# EAGLE design gameboy (EAGLE 9.4.0)
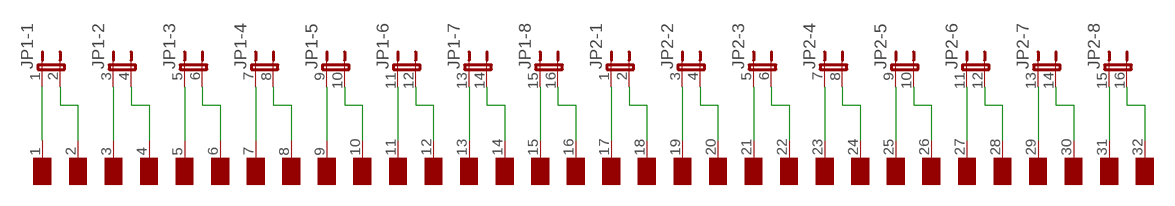
[diagram p0: schematic, sheet 1]

## Parts
JP1  JP8QE  [JP8Q]
JP2  JP8QE  [JP8Q]
U$1  CONNECTOR  [CONNECTOR]

## Nets
N$1: JP1.1 U$1.1(VDD)
N$2: JP1.2 U$1.2(NC)
N$3: JP1.3 U$1.3(/WR)
N$4: JP1.4 U$1.4(/RD)
N$5: JP1.5 U$1.5(/RCS)
N$6: JP1.6 U$1.6(A0)
N$7: JP1.7 U$1.7(A1)
N$8: JP1.8 U$1.8(A2)
N$9: JP1.9 U$1.9(A3)
N$10: JP1.10 U$1.10(A4)
N$11: JP1.11 U$1.11(A5)
N$12: JP1.12 U$1.12(A6)
N$13: JP1.13 U$1.13(A7)
N$14: JP1.14 U$1.14(A8)
N$15: JP1.15 U$1.15(A9)
N$16: JP1.16 U$1.16(A10)
N$17: JP2.1 U$1.17(A11)
N$18: JP2.2 U$1.18(A12)
N$19: JP2.3 U$1.19(A13)
N$20: JP2.4 U$1.20(A14)
N$21: JP2.5 U$1.21(A15)
N$22: JP2.6 U$1.22(D0)
N$23: JP2.7 U$1.23(D1)
N$24: JP2.8 U$1.24(D2)
N$25: JP2.9 U$1.25(D3)
N$26: JP2.10 U$1.26(D4)
N$27: JP2.11 U$1.27(D5)
N$28: JP2.12 U$1.28(D6)
N$29: JP2.13 U$1.29(D7)
N$30: JP2.14 U$1.30(/RS)
N$31: JP2.15 U$1.31(VIN)
N$32: JP2.16 U$1.32(GND)

## Library data of the parts
JP1 JP2 = jumper:JP8QE: JUMPER
U$1 = gameboy:CONNECTOR: Connector Pads for Gameboy Cartridges

## Board
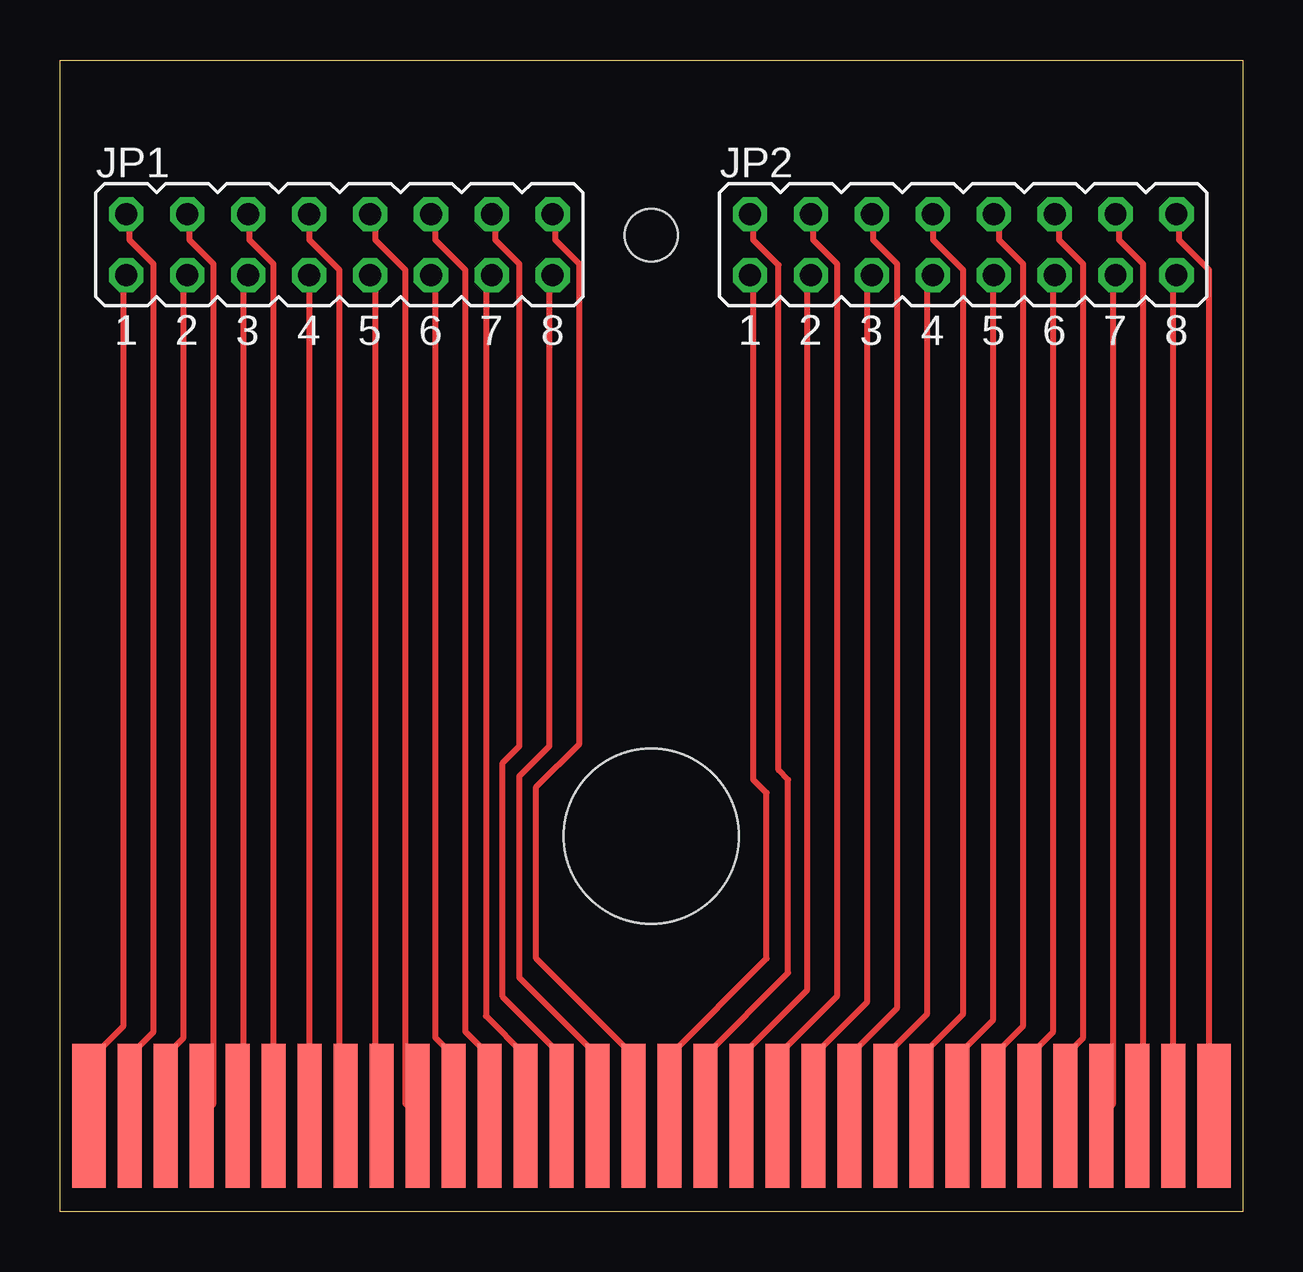
[diagram p1: board, top side]

Size 49.3 x 48 mm. Coordinates in mm from the lower left corner, seen from the top.
Outline: 0,48 49.3,48 49.3,0 0,0 0,48
Copper layers (1*16): Top 0.035mm / dielectric 1.5mm / Bottom 0.035mm
Design rules "default": minimum track width 10mil, minimum drill 24mil, track to track 8mil, track to pad 8mil, pad to pad 8mil, via to via 8mil, smd to smd 8mil, copper to edge 40mil, drill to drill 8mil, minimum pad ring 10mil, minimum via ring 8mil, stop-mask expansion 4mil, vias tented up to drill 0mil, thermal gap 10mil
Holes 7.3 mm at 24.65,15.65
Holes 2.2 mm at 24.65,40.7

### Footprints (pad centres in the part's own frame; a part is rotated, then mirrored left to right if it is on the bottom)
JP8Q = drill 0.914 octagon: 1 -8.89,-1.27; 2 -8.89,1.27; 3 -6.35,-1.27; 4 -6.35,1.27; 5 -3.81,-1.27; 6 -3.81,1.27; 7 -1.27,-1.27; 8 -1.27,1.27; 9 1.27,-1.27; 10 1.27,1.27; 11 3.81,-1.27; 12 3.81,1.27; 13 6.35,-1.27; 14 6.35,1.27; 15 8.89,-1.27; 16 8.89,1.27
CONNECTOR = smd 1.4 x 6: 1 0.7,-3; 32 47.6,-3 | smd 1 x 6: 2 2.4,-3; 3 3.9,-3; 4 5.4,-3; 5 6.9,-3; 6 8.4,-3; 7 9.9,-3; 8 11.4,-3; 9 12.9,-3; 10 14.4,-3; 11 15.9,-3; 12 17.4,-3; 13 18.9,-3; 14 20.4,-3; 15 21.9,-3; 16 23.4,-3; 17 24.9,-3; 18 26.4,-3; 19 27.9,-3; 20 29.4,-3; 21 30.9,-3; 22 32.4,-3; 23 33.9,-3; 24 35.4,-3; 25 36.9,-3; 26 38.4,-3; 27 39.9,-3; 28 41.4,-3; 29 42.9,-3; 30 44.4,-3; 31 45.9,-3

### Placement (x,y rotation side)
JP1  11.65,40.3 0 top
JP2  37.65,40.3 0 top
U$1  0.5,7 0 top

### Tracks (layer width: path | path; a pad name or v marks a point on that pad's centre or on a via)
N$1
  Top 0.254: JP1.1 2.65,39 2.65,7.75 1.4,6.5 1.4,4 U$1.1
N$2
  Top 0.254: U$1.2 2.9,6.5 3.9,7.5 3.9,39.5 2.9,40.5 2.9,41.5 JP1.2
N$3
  Top 0.254: U$1.3 4.4,6.5 5.15,7.25 5.15,39 JP1.3
N$4
  Top 0.254: U$1.4 6.4,4.5 6.4,39.5 5.4,40.5 5.4,41.5 JP1.4
N$5
  Top 0.254: U$1.5 7.65,4.25 7.65,39 JP1.5
N$6
  Top 0.254: U$1.6 8.9,39.5 7.9,40.5 7.9,41.5 JP1.6
N$7
  Top 0.254: U$1.7 10.4,39 JP1.7
N$8
  Top 0.254: U$1.8 11.65,4.25 11.65,39.25 10.4,40.5 10.4,41.5 JP1.8
N$9
  Top 0.254: U$1.9 13.15,4.25 13.15,39 JP1.9
N$10
  Top 0.254: U$1.10 14.4,4.5 14.4,39.25 13.15,40.5 13.15,41.5 JP1.10
N$11
  Top 0.254: U$1.11 16.4,6.5 15.65,7.25 15.65,39 JP1.11
N$12
  Top 0.254: U$1.12 17.9,6.5 16.9,7.5 16.9,39.25 15.65,40.5 15.65,41.5 JP1.12
N$13
  Top 0.254: JP1.13 17.75,38.78 17.75,8.15 19.4,6.5 U$1.13
N$14
  Top 0.254: U$1.14 20.9,6.5 18.45,8.95 18.45,18.7 19.15,19.4 19.15,39.5 18.15,40.5 18.15,41.5 JP1.14
N$15
  Top 0.254: U$1.15 22.4,6.5 19.15,9.75 19.15,18.15 20.4,19.4 20.4,39 JP1.15
N$16
  Top 0.254: U$1.16 23.9,6.5 19.85,10.55 19.85,17.7 21.65,19.5 21.65,39.5 20.65,40.5 20.65,41.5 JP1.16
N$17
  Top 0.254: U$1.17 25.4,6.5 29.45,10.55 29.45,17.45 28.9,18 28.9,39 JP2.1
N$18
  Top 0.254: U$1.18 26.9,6.5 30.35,9.95 30.35,18 29.95,18.4 29.95,39.45 28.9,40.5 28.9,41.5 JP2.2
N$19
  Top 0.254: U$1.19 28.4,6.5 31.15,9.25 31.15,39 JP2.3
N$20
  Top 0.254: U$1.20 29.9,6.5 32.4,9 32.4,39.5 31.4,40.5 31.4,41.5 JP2.4
N$21
  Top 0.254: U$1.21 31.4,6.5 33.65,8.75 33.65,39 JP2.5
N$22
  Top 0.254: U$1.22 32.9,6.5 34.9,8.5 34.9,39.5 33.9,40.5 33.9,41.5 JP2.6
N$23
  Top 0.254: U$1.23 34.4,6.5 36.15,8.25 36.15,39 JP2.7
N$24
  Top 0.254: U$1.24 35.9,6.5 37.65,8.25 37.65,39.25 36.4,40.5 36.4,41.5 JP2.8
N$25
  Top 0.254: U$1.25 37.4,6.5 38.9,8 38.9,39 JP2.9
N$26
  Top 0.254: U$1.26 38.9,6.5 40.15,7.75 40.15,39.5 39.15,40.5 39.15,41.5 JP2.10
N$27
  Top 0.254: U$1.27 40.4,6.5 41.4,7.5 41.4,39 JP2.11
N$28
  Top 0.254: U$1.28 41.9,6.5 42.65,7.25 42.65,39.5 41.65,40.5 41.65,41.5 JP2.12
N$29
  Top 0.254: U$1.29 43.9,4.5 43.9,39 JP2.13
N$30
  Top 0.254: U$1.30 45.15,4.25 45.15,39.5 44.15,40.5 44.15,41.5 JP2.14
N$31
  Top 0.254: U$1.31 46.4,39 JP2.15
N$32
  Top 0.254: JP2.16 46.65,41.5 46.65,40.5 47.9,39.25 47.9,4 U$1.32

### Text on the board
bNames: HACK ME